# EAGLE design ECG V1.1 (EAGLE 9.5.1)
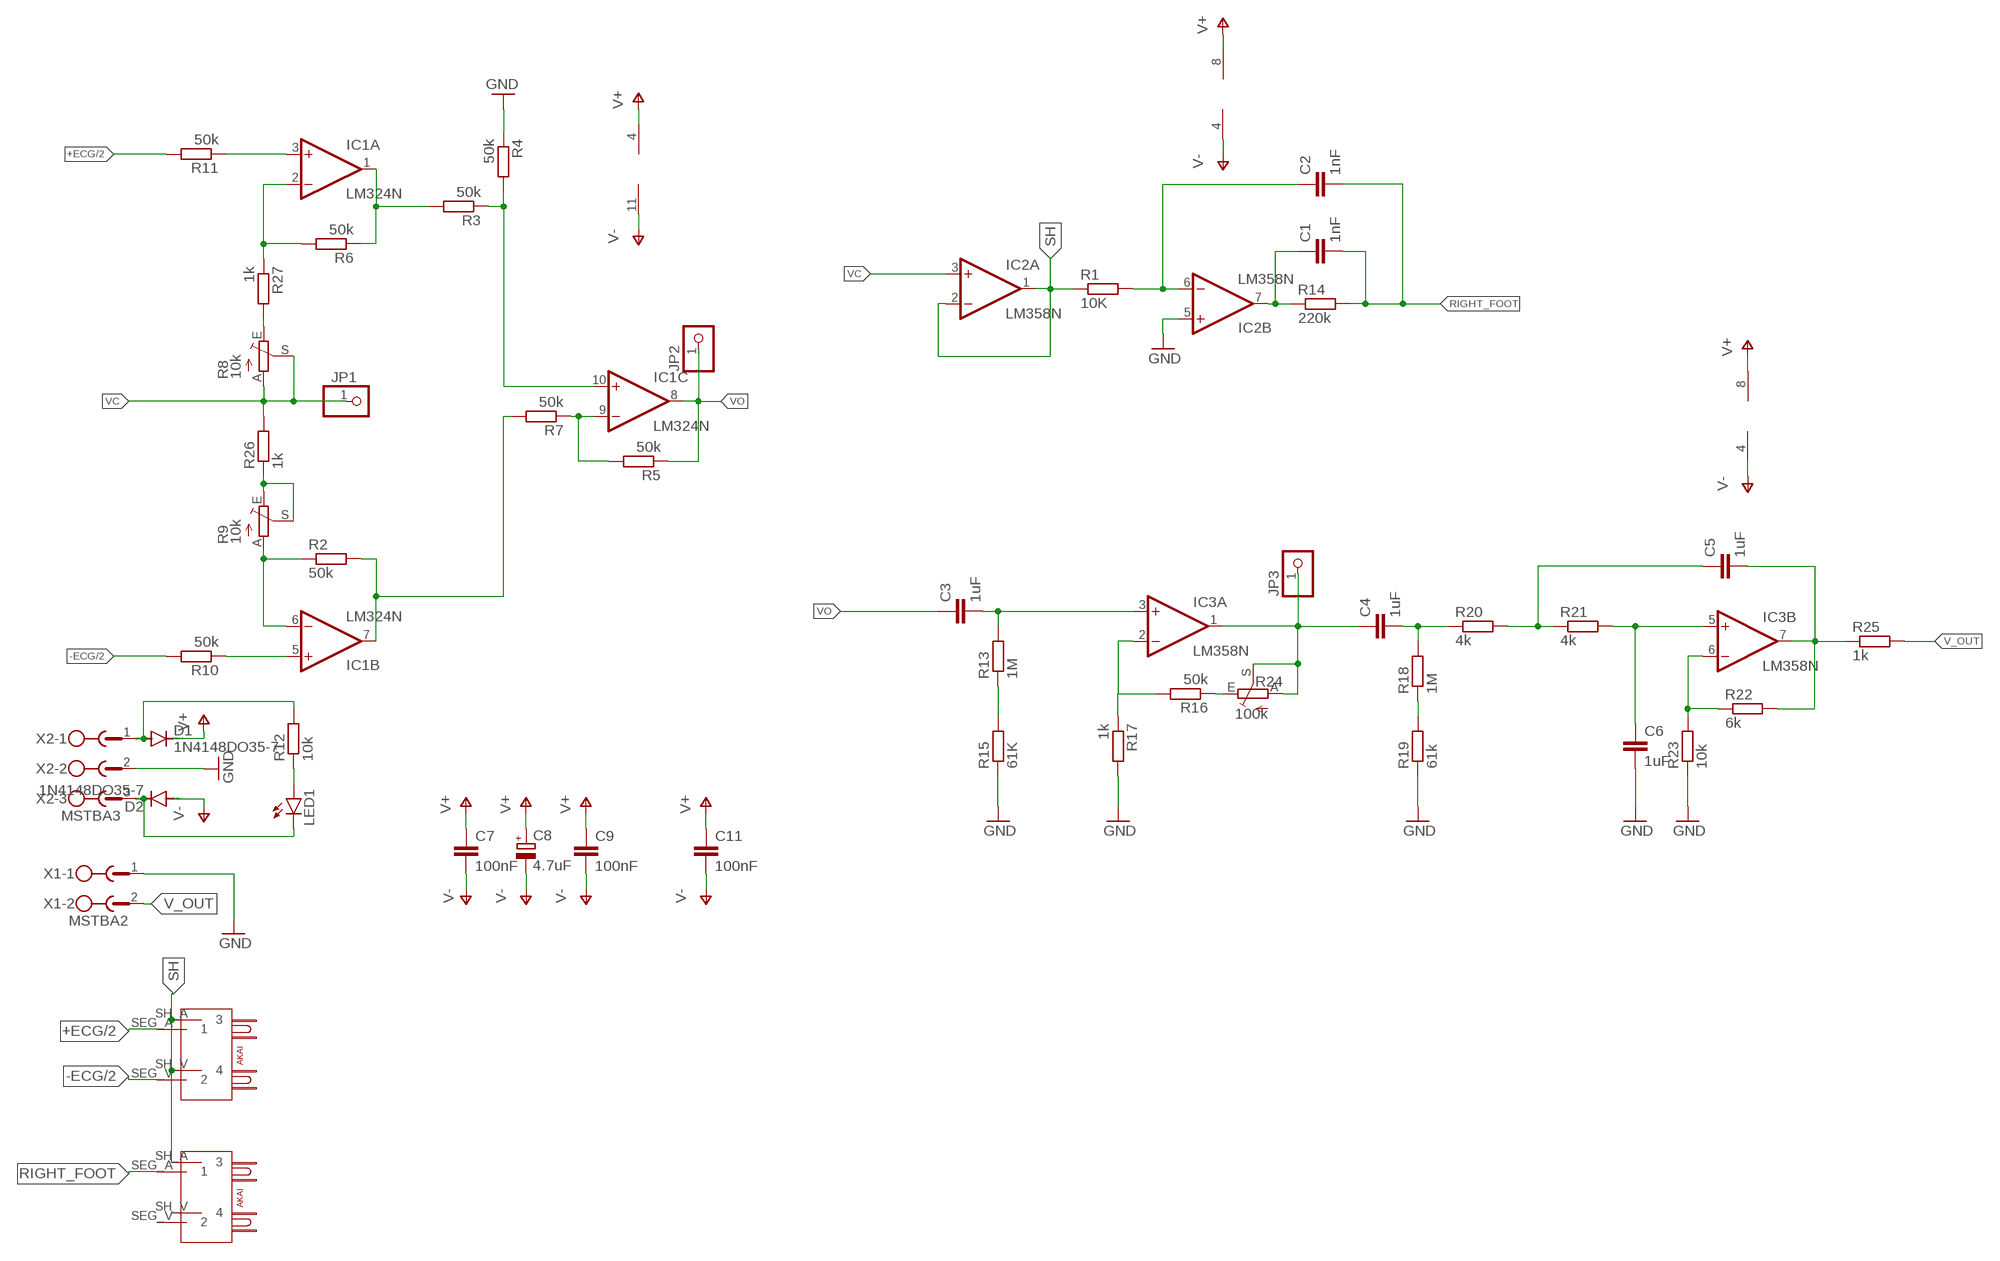
[diagram p0: schematic, sheet 1]

## Parts
C1  1nF  C-EU050-024X044  [C050-024X044]
C2  1nF  C-EU050-024X044  [C050-024X044]
C3  1uF  C-EU075-032X103  [C075-032X103]
C4  1uF  C-EU050-024X044  [C050-024X044]
C5  1uF  C-EU050-024X044  [C050-024X044]
C6  1uF  C-EU050-024X044  [C050-024X044]
C7  100nF  C-EU050-024X044  [C050-024X044]
C8  4.7uF  CPOL-EUE2-4  [E2-4]
C9  100nF  C-EU050-024X044  [C050-024X044]
C11  100nF  C-EU050-024X044  [C050-024X044]
D1  1N4148DO35-7  [DO35-7]
D2  1N4148DO35-7  [DO35-7]
IC1  LM324N  [DIL14]
IC2  LM358N  [DIL08]
IC3  LM358N  [DIL08]
JP1  PINHD-1X1  [1X01]
JP2  PINHD-1X1  [1X01]
JP3  PINHD-1X1  [1X01]
LED1  LED3MM  [LED3MM]
R1  10K  R-EU_0207/7  [0207/7]
R2  50k  R-EU_0207/7  [0207/7]
R3  50k  R-EU_0207/7  [0207/7]
R4  50k  R-EU_0207/7  [0207/7]
R5  50k  R-EU_0207/7  [0207/7]
R6  50k  R-EU_0207/7  [0207/7]
R7  50k  R-EU_0207/7  [0207/7]
R8  10k  TRIM_EU-S64W  [S64W]
R9  10k  TRIM_EU-S64W  [S64W]
R10  50k  R-EU_0207/7  [0207/7]
R11  50k  R-EU_0207/7  [0207/7]
R12  10k  R-EU_0207/7  [0207/7]
R13  1M  R-EU_0207/7  [0207/7]
R14  220k  R-EU_0207/7  [0207/7]
R15  61K  R-EU_0207/7  [0207/7]
R16  50k  R-EU_0207/7  [0207/7]
R17  1k  R-EU_0207/7  [0207/7]
R18  1M  R-EU_0207/7  [0207/7]
R19  61k  R-EU_0207/7  [0207/7]
R20  4k  R-EU_0207/7  [0207/7]
R21  4k  R-EU_0207/7  [0207/7]
R22  6k  R-EU_0207/7  [0207/7]
R23  10k  R-EU_0207/7  [0207/7]
R24  100k  TRIM_EU-S64W  [S64W]
R25  1k  R-EU_0207/7  [0207/7]
R26  1k  R-EU_0207/7  [0207/7]
R27  1k  R-EU_0207/7  [0207/7]
U$1  AKAI  [DUAL_AKAI]
U$2  AKAI  [DUAL_AKAI]
X1  MSTBA2  [MSTBA2]
X2  MSTBA3  [MSTBA3]

## Nets
+ECG/2: R11.2 U$1.SEG_A
-ECG/2: R10.2 U$1.SEG_V
GND: C6.2 IC2.5(B:+IN) R4.1 R15.1 R17.2 R19.1 R23.1 X1.1 X2.2
N$1: IC1.1(A:OUT) R3.2 R6.1
N$2: IC1.6(B:-IN) R2.1 R9.A
N$3: IC1.7(B:OUT) R2.2 R7.2
N$4: IC1.2(A:-IN) R6.2 R27.1
N$5: IC1.10(C:+IN) R3.1 R4.2
N$6: IC1.9(C:-IN) R5.2 R7.1
N$7: R16.1 R24.E
N$8: C3.2 IC3.3(A:+IN) R13.2
N$9: D2.C LED1.K(C) X2.3
N$10: C2.1 IC2.6(B:-IN) R1.2
N$11: C1.1 IC2.7(B:OUT) R14.1
N$12: R13.1 R15.2
N$13: D1.A R12.2 X2.1
N$14: C4.1 IC3.1(A:OUT) JP3.1 R24.A R24.S
N$15: IC3.2(A:-IN) R16.2 R17.1
N$16: C5.1 R20.2 R21.1
N$17: R18.1 R19.2
N$18: C4.2 R18.2 R20.1
N$19: C6.1 IC3.5(B:+IN) R21.2
N$20: IC3.6(B:-IN) R22.1 R23.2
N$21: R8.E R27.2
N$22: IC1.5(B:+IN) R10.1
N$26: IC1.3(A:+IN) R11.1
N$27: LED1.A R12.1
N$28: R9.E R9.S R26.1
OUT: C5.2 IC3.7(B:OUT) R22.2 R25.1
RIGHT_FOOT: C1.2 C2.2 R14.2 U$2.SEG_A
SH: IC2.1(A:OUT) IC2.2(A:-IN) R1.1 U$1.SH_A U$1.SH_V U$2.SH_A
V+: C7.1 C8.+ C9.1 C11.1 D1.C IC1.4(P:V+) IC2.8(P:V+) IC3.8(P:V+)
V-: C7.2 C8.- C9.2 C11.2 D2.A IC1.11(P:V-) IC2.4(P:V-) IC3.4(P:V-)
V_OUT: R25.2 X1.2
VC: IC2.3(A:+IN) JP1.1 R8.A R8.S R26.2
VO: C3.1 IC1.8(C:OUT) JP2.1 R5.1
Unconnected: IC1.12(D:+IN) IC1.13(D:-IN) IC1.14(D:OUT) U$2.SEG_V U$2.SH_V

## Library data of the parts
C1-C7 C9 C11 = rcl:C-EU: CAPACITOR, European symbol; SPICEPREFIX: C
C8 = rcl:CPOL-EU: POLARIZED CAPACITOR, European symbol; SPICEPREFIX: C
D1 D2 = diode:1N4148: DIODE high speed (Philips)
IC1 = linear:LM324: OP AMP
IC2 IC3 = linear:LM358: OP AMP also LM158; LM258; LM2904 Source: http://cache.national.com/ds/LM/LM158.pdf
JP1-JP3 = pinhead:PINHD-1X1: PIN HEADER
LED1 = led:LED: LED OSRAM: - CHIPLED LG R971, LG N971, LY N971, LG Q971, LY Q971, LO R971, LY R971 LH N974, LH R974 LS Q976, LO Q976, LY Q976 LO Q996 - Hyper CHIPLED LW Q18S LB Q993, LB Q99A, LB R99A - SideLED LS A670, LO A670, LY A670, LG A670, LP A670 LB A673, LV A673, LT A673, LW A673 LH A674 LY A675 LS A676, LA A676, LO A676, LY A676, LW A676 LS A679, LY A679, LG A679 - Hyper Micro SIDELED® LS Y876, LA Y876, LO Y876, LY Y876 LT Y87S - SmartLED LW L88C, LW L88S LB L89C, LB L89S, LG L890 LS L89K, LO L89K, LY L89K LS L896, LA L896, LO L896, LY L896 - TOPLED LS T670, LO T670, LY T670, LG T670, LP T670 LSG T670, LSP T670, LSY T670, LOP T670, LYG T670 LG T671, LOG T671, LSG T671 LB T673, LV T673, LT T673, LW T673 LH T674 LS T676, LA T676, LO T676, LY T676, LB T676, LH T676, LSB T676, LW T676 LB T67C, LV T67C, LT T67C, LS T67K, LO T67K, LY T67K, LW E67C LS E67B, LA E67B, LO E67B, LY E67B, LB E67C, LV E67C, LT E67C LW T67C LS T679, LY T679, LG T679 LS T770, LO T770, LY T770, LG T770, LP T770 LB T773, LV T773, LT T773, LW T773 LH T774 LS E675, LA E675, LY E675, LS T675 LS T776, LA T776, LO T776, LY T776, LB T776 LHGB T686 LT T68C, LB T68C - Hyper Mini TOPLED® LB M676 - Mini TOPLED Santana® LG M470 LS M47K, LO M47K, LY M47K Source: http://www.osram.convergy.de LUXEON: - LUMILED® LXK2-PW12-R00, LXK2-PW12-S00, LXK2-PW14-U00, LXK2-PW14-V00 LXK2-PM12-R00, LXK2-PM12-S00, LXK2-PM14-U00 LXK2-PE12-Q00, LXK2-PE12-R00, LXK2-PE12-S00, LXK2-PE14-T00, LXK2-PE14-U00 LXK2-PB12-K00, LXK2-PB12-L00, LXK2-PB12-M00, LXK2-PB14-N00, LXK2-PB14-P00, LXK2-PB14-Q00 LXK2-PR12-L00, LXK2-PR12-M00, LXK2-PR14-Q00, LXK2-PR14-R00 LXK2-PD12-Q00, LXK2-PD12-R00, LXK2-PD12-S00 LXK2-PH12-R00, LXK2-PH12-S00 LXK2-PL12-P00, LXK2-PL12-Q00, LXK2-PL12-R00 Source: www.luxeon.com KINGBRIGHT: KA-3528ASYC Source: www.kingbright.com
R1-R7 R10-R23 R25-R27 = rcl:R-EU_: RESISTOR, European symbol; SPICEPREFIX: R
R8 R9 R24 = pot:TRIM_EU-: POTENTIOMETER
U$1 U$2 = AKAI_by_AMIR:AKAI
X1 = con-phoenix-508:MSTBA2: PHOENIX; MF: FARNELL; MPN: 1757242; OC_FARNELL: 3705171; OC_NEWARK: 71C4161
X2 = con-phoenix-508:MSTBA3: PHOENIX; MF: FARNELL; MPN: 1757255; OC_FARNELL: 3705183; OC_NEWARK: 71C4162

## Board
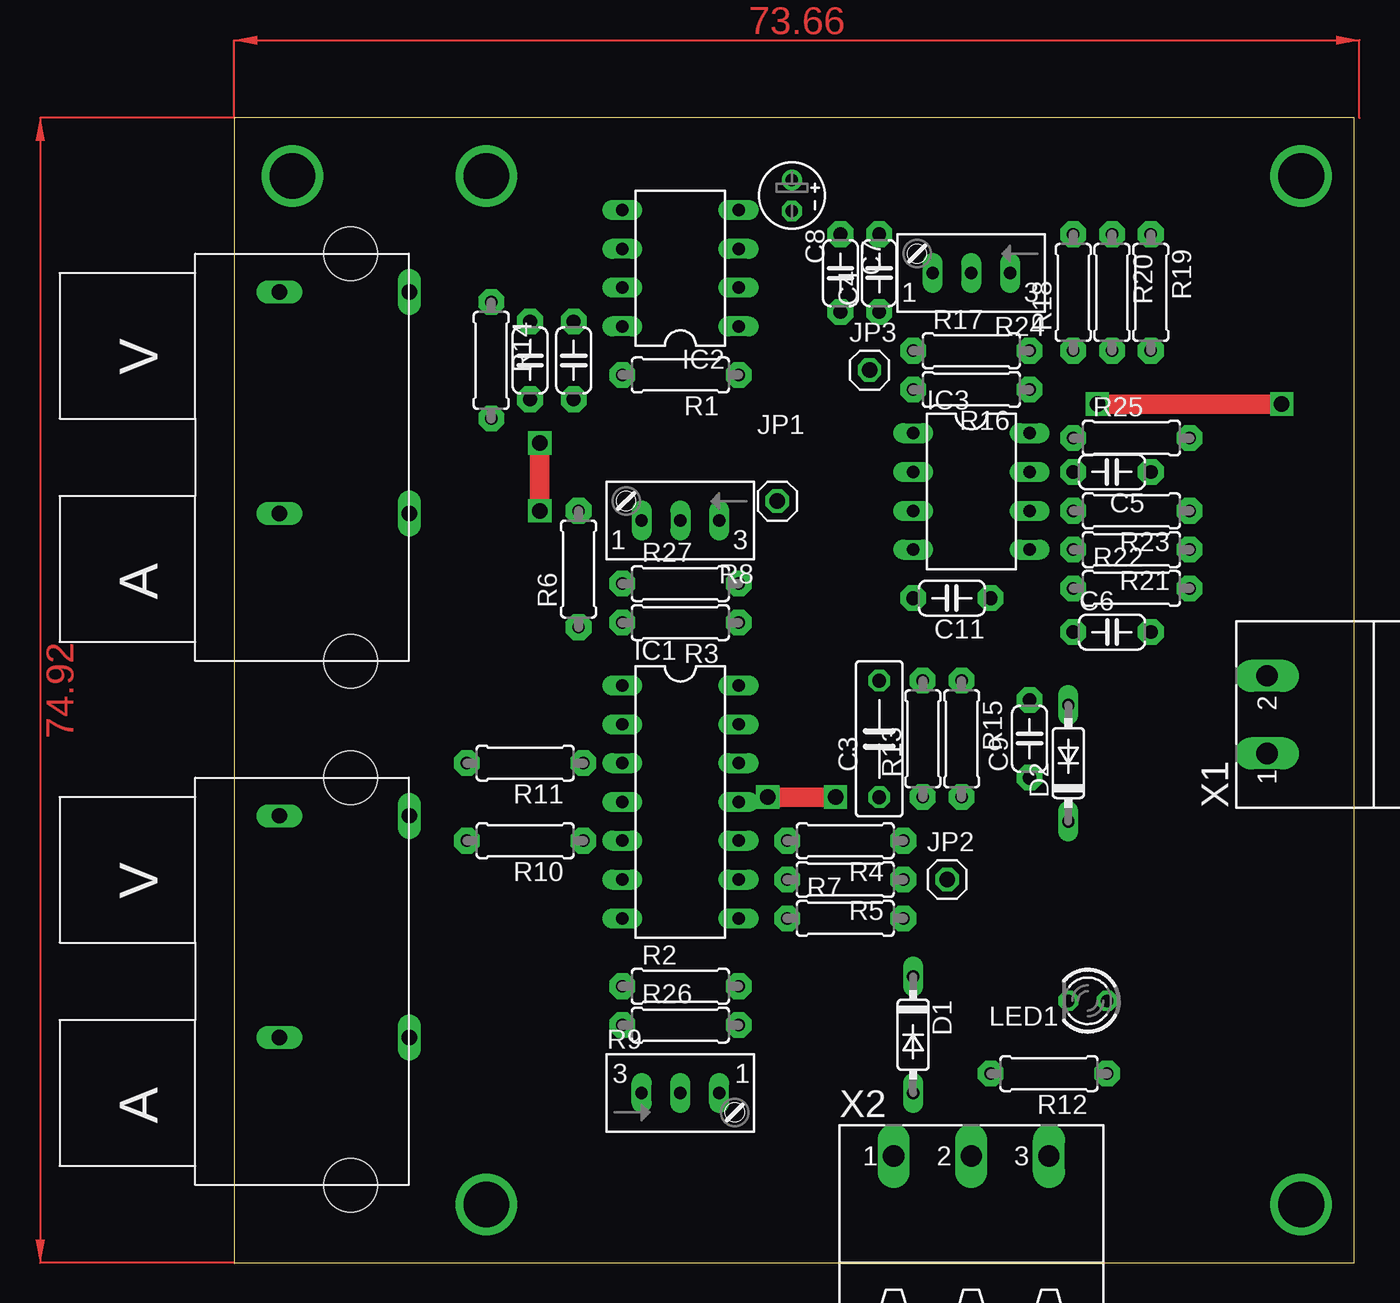
[diagram p1: board, top side]
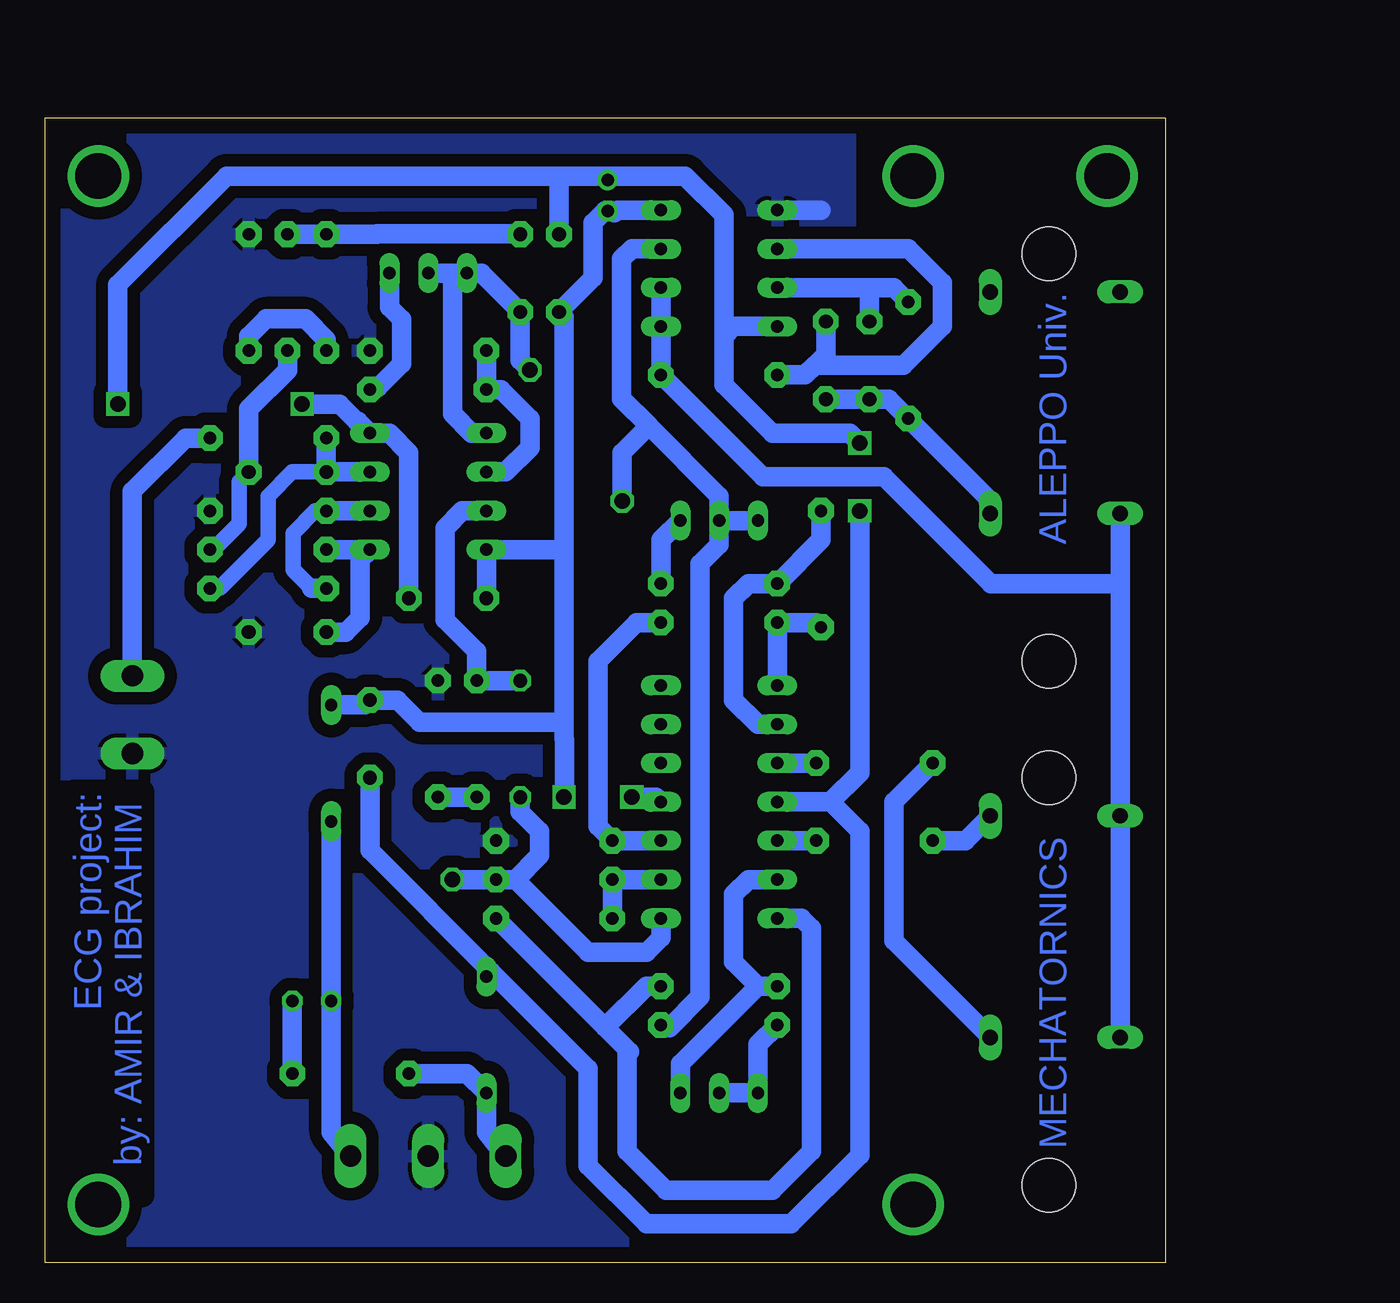
[diagram p2: board, bottom side, seen from below]

Size 73.33 x 74.92 mm. Coordinates in mm from the lower left corner, seen from the top.
Outline: 0,0 73.33,0 73.33,74.92 0,74.92 0,0
Copper layers (1*16): Top 0.035mm / dielectric 0.15mm / Bottom 0.035mm
Design rules "default *": minimum track width 6mil, minimum drill 0.35mm, track to track 24mil, track to pad 24mil, pad to pad 16mil, via to via 6mil, smd to smd 6mil, copper to edge 40mil, drill to drill 6mil, minimum pad ring 10mil, minimum via ring 8mil, stop-mask expansion 4mil, vias tented up to drill 0mil, thermal gap 10mil

### Footprints (pad centres in the part's own frame; a part is rotated, then mirrored left to right if it is on the bottom)
C050-024X044 = drill 0.9 pad 1.676 octagon: 1 -2.54,0; 2 2.54,0
C075-032X103 = drill 0.914 octagon: 1 -3.81,0; 2 3.81,0
E2-4 = drill 0.813 pad 1.27: + -1.016,0 | drill 0.813 pad 1.27 octagon: - 1.016,0
DO35-7 = drill 0.813 long: A 3.81,0; C -3.81,0
DIL14 = drill 0.813 long: 1 -7.62,-3.81; 2 -5.08,-3.81; 3 -2.54,-3.81; 4 0,-3.81; 5 2.54,-3.81; 6 5.08,-3.81; 7 7.62,-3.81; 8 7.62,3.81; 9 5.08,3.81; 10 2.54,3.81; 11 0,3.81; 12 -2.54,3.81; 13 -5.08,3.81; 14 -7.62,3.81
DIL08 = drill 0.813 pad 1.27 long: 1 -3.81,-3.81; 2 -1.27,-3.81; 3 1.27,-3.81; 4 3.81,-3.81; 5 3.81,3.81; 6 1.27,3.81; 7 -1.27,3.81; 8 -3.81,3.81
1X01 = drill 1.016 octagon: 1 0,0
LED3MM = drill 0.813 octagon: A -1.27,0; K 1.27,0
0207/7 = drill 0.813 pad 1.676 octagon: 1 -3.81,0; 2 3.81,0
S64W = drill 0.813 long: A 2.54,1.27; E -2.54,1.27; S 0,1.27
DUAL_AKAI = drill 1 long: SEG_A 17,14; SEG_V 2.5,14; SH_A 17,5.5; SH_V 2.5,5.5 | hole 3.5: 0,10.16; 26.67,10.16
MSTBA2 = drill 1.397 long: 1 -2.54,5.08; 2 2.54,5.08
MSTBA3 = drill 1.397 long: 1 -5.08,5.08; 2 0,5.08; 3 5.08,5.08

### Placement (x,y rotation side)
C1  19.37,59.05 270 top
C2  22.23,59.05 270 top
C3  42.23,34.29 90 top
C4  42.23,64.77 90 top
C5  57.47,51.75 180 top
C6  57.47,41.28 0 top
C7  39.69,64.77 270 top
C8  36.51,69.85 270 top
C9  52.07,34.29 90 top
C11  46.99,43.5 180 top
D1  44.45,14.92 270 top
D2  54.61,32.7 90 top
IC1  29.21,30.16 270 top
IC2  29.21,65.09 90 top
IC3  48.26,50.48 270 top
JP1  35.56,49.85 0 top
JP2  46.67,25.08 0 top
JP3  41.59,58.42 0 top
LED1  55.88,17.14 180 top
R1  29.21,58.1 180 top
R2  29.21,18.1 0 top
R3  29.21,41.9 180 top
R4  40.01,27.62 180 top
R5  40.01,25.08 180 top
R6  22.54,45.4 90 top
R7  40.01,22.54 0 top
R8  29.21,49.85 180 top
R9  29.21,9.84 0 top
R10  19.05,27.62 180 top
R11  19.05,32.7 180 top
R12  53.34,12.38 180 top
R13  45.09,34.29 90 top
R14  16.83,59.05 270 top
R15  47.62,34.29 270 top
R16  48.26,57.15 180 top
R17  48.26,59.69 0 top
R18  54.93,63.5 90 top
R19  60.01,63.5 270 top
R20  57.47,63.5 270 top
R21  58.74,46.67 180 top
R22  58.74,44.13 0 top
R23  58.74,49.21 180 top
R24  48.26,66.04 180 top
R25  58.74,53.98 0 top
R26  29.21,15.56 0 top
R27  29.21,44.45 0 top
U$1  -2.54,31.75 270 top
U$2  -2.54,66.04 270 top
X1  72.71,35.88 90 top
X2  48.26,1.91 0 top

### Tracks (layer width: path | path; a pad name or v marks a point on that pad's centre or on a via)
+ECG/2
  Bottom 1.27: R11.2 17.78,30.16 17.78,21.07 U$1.SEG_A
-ECG/2
  Bottom 1.27: R10.2 13.09,27.62 U$1.SEG_V
GND
  Bottom 1.27: IC2.5 22.54,68.9
  pour Bottom (isolate 0.813): 20.64,81.28 95.25,81.28 95.25,0 20.64,0
N$1
  Bottom 1.27: IC1.1 R3.2 22.85,41.9 R6.1
N$2
  Bottom 1.27: IC1.6 27.3,25.08 28.26,24.13 28.26,19.68 26.67,18.1 | R2.1 26.67,18.1 | 26.67,18.1 31.75,13.02 R9.A
N$3
  Bottom 1.27: IC1.7 23.81,22.54 23.18,21.91 23.18,7.3 25.72,4.76 32.7,4.76 35.24,7.3 35.24,13.65 35.08,13.81 36.67,15.4 | 36.67,15.4 33.97,18.1 R2.2 | R7.2 36.67,15.4
N$4
  Bottom 1.27: IC1.2 26.67,35.24 28.26,36.83 28.26,43.5 27.3,44.45 R27.1 22.54,47.31 R6.2
N$5
  Bottom 1.27: IC1.10 R4.2 37.15,28.57 37.15,39.37 34.62,41.9 R3.1
N$6
  Bottom 1.27: R7.1 R5.2 IC1.9
N$7
  Bottom 1.27: R24.E 50.8,62.55 49.99,61.74 49.99,58.83 51.52,57.29 51.93,57.29 R16.1
N$8
  Bottom 1.27: C3.2 R13.2 45.09,40.01 47.17,42.09 47.17,48.08 46.04,49.21 IC3.3
N$9
  Bottom 1.27: X2.3 54.61,8.55 LED1.K D2.C
N$10
  Bottom 1.27: IC2.6 16.83,66.36 14.6,64.14 14.6,61.28 17.15,58.74 22.95,58.74 | R1.2 23.58,58.1 22.95,58.74 | 22.95,58.74 22.23,59.46 C2.1
N$11
  Bottom 1.27: IC2.7 19.37,63.82 | 19.37,63.82 17.78,63.82 R14.1 | C1.1 19.37,63.82
N$12
  Bottom 1.27: R13.1 R15.2
N$13
  Bottom 1.27: X2.1 44.45,8.55 D1.A 45.72,12.38 R12.2
N$14
  Bottom 1.27: R24.S 46.67,64.77 | 46.67,64.77 R24.A 44.77,64.77 C4.1 42.23,59.05 JP3.1 | 46.67,64.77 46.67,55.56 45.4,54.29 IC3.1
N$15
  Bottom 1.27: R17.1 R16.2 43.5,57.15 41.59,55.25 41.59,53.34 43.18,51.75 IC3.2
N$16
  Bottom 1.016: R21.1 62.32,46.67 60.64,48.35 60.64,51.12 C5.1
  Bottom 1.27: R20.2 57.47,58.42 60.01,55.88 C5.1
N$17
  Bottom 1.27: R18.1 54.93,60.41 56.29,61.77 58.88,61.77 60.01,60.64 R19.2
N$18
  Bottom 1.27: R20.1 R18.2 51.61,67.31 51.59,67.33 42.25,67.33 C4.2
N$19
  Bottom 1.27: R21.2 IC3.5 52.7,46.04 52.7,42.23 53.66,41.28 C6.1
N$20
  Bottom 1.016: R23.2 55.65,49.21 57.11,47.75 57.11,45.36 55.88,44.13
  Bottom 1.27: IC3.6 R23.2 | R22.1 55.88,44.13
N$21
  Bottom 1.27: R27.2 33.02,47.31 R8.E
N$22
  Bottom 1.27: IC1.5 R10.1
N$23  (via drill 3)
  other vias: 3.81,71.12
N$24  (via drill 3)
  other vias: 69.85,71.12
N$25  (via drill 3)
  other vias: 69.85,3.81
N$26
  Bottom 1.27: R11.1 IC1.3
N$27
  Bottom 1.27: R12.1 LED1.A
N$28
  Bottom 1.27: R26.1 26.67,14.29 R9.E R9.S
N$29  (via drill 3)
  other vias: 16.51,3.81
N$30  (via drill 3)
  other vias: 16.51,71.12
OUT
  Bottom 1.016: C5.2 57.15,51.75 58.74,50.17 58.74,47.31 61.91,44.13 R22.2
  Bottom 1.27: IC3.7 C5.2 R25.1
RIGHT_FOOT
  Bottom 1.27: C2.2 C1.2 18.1,56.52 R14.2 11.46,49.88 U$2.SEG_A
SH
  Bottom 1.27: IC2.2 IC2.1 R1.1 26.35,51.44 18.41,51.44 11.43,44.45 2.96,44.45 | U$1.SH_A U$1.SH_V 2.96,44.45 | U$2.SH_A 2.96,44.45
V+  (via drill 1.02)
  Top 1.27: v56.52,56.2 v68.58,56.2 | v20,53.66 v20,49.21
  Bottom 1.27: IC2.8 28.26,61.28 28.89,60.64 | 28.89,60.64 28.89,57.47 25.72,54.29 20.64,54.29 v20,53.66 | 21.91,30.16 20,32.07 v20,49.21 | IC1.4 21.91,30.16 | v56.52,56.2 54.06,56.2 52.93,55.07 52.84,55.07 IC3.8 50.8,54.29 49.53,53.02 C11.1 | 21.91,30.16 20,28.26 20,7.05 24.51,2.54 33.97,2.54 37.78,6.35 37.78,12.7 44.13,19.05 | 28.89,60.64 28.89,68.58 31.43,71.12 36.51,71.12 | 36.51,71.12 39.69,71.12 | 39.69,71.12 61.45,71.12 68.58,64 v68.58,56.2 | C7.1 39.69,71.12 | C8.+ 36.51,71.12 | 44.13,19.05 52.07,26.99 C9.1 | D1.C 44.13,19.05
V-  (via drill 1.02)
  Top 1.27: v34.93,30.48 v39.37,30.48
  Bottom 1.27: 39.37,46.67 IC3.4 C11.2 | IC2.4 35.88,68.9 36.07,68.71 36.2,68.83 C8.- 36.69,68.83 37.47,68.06 37.47,64.45 C7.2 39.37,61.91 39.37,46.67 | IC1.11 33.34,30.48 v34.93,30.48 | 39.37,35.38 48.8,35.38 50.25,36.83 C9.2 52.39,36.51 D2.A | v39.37,30.48 39.32,30.53 39.32,34.24 39.37,34.29 39.37,35.38 | 39.37,35.38 39.37,46.67
V_OUT
  Bottom 1.27: X1.2 67.63,50.48 64.14,53.98 R25.2
VC
  Bottom 1.27: R26.2 32.84,15.38 32.48,15.38 30.45,17.4 30.45,45.75 29.21,46.99 R8.S | R8.A R8.S | IC2.3 34.93,66.36 35.59,65.7 35.59,56.54 33.81,54.77 | 33.81,54.77 29.21,50.17 R8.S | JP1.1 35.56,53.02 33.81,54.77
VO
  Bottom 1.27: 42.55,25.08 R5.1 JP2.1 | IC1.8 33.02,21.27 33.97,20.32 37.78,20.32 42.55,25.08 | C3.1 42.23,29.53 40.96,28.26 40.96,26.67 42.55,25.08
(copper drawn outside any net)
  shapes: Top area x2

### Text on the board
Bottom: ALEPPO Univ. | ECG project: / by: AMIR & IBRAHIM | MECHATORNICS